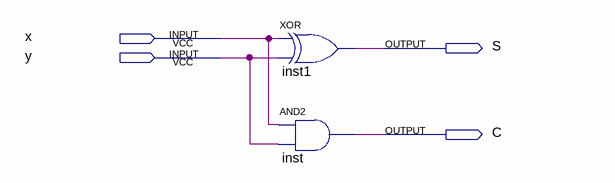
[diagram p0: schematic sheet]
// Quartus schematic Meio_Somador.bdf as structural Verilog: 2 symbols, 4 pins
module Meio_Somador (
  input  x,
  input  y,
  output S,
  output C
);

  xor inst1 (S, x, y);
  and inst (C, x, y);
endmodule
